# Altium schematic sheet Power.SchDoc
size 420 x 297 mm; SheetNumber: 3; SheetTotal: 5
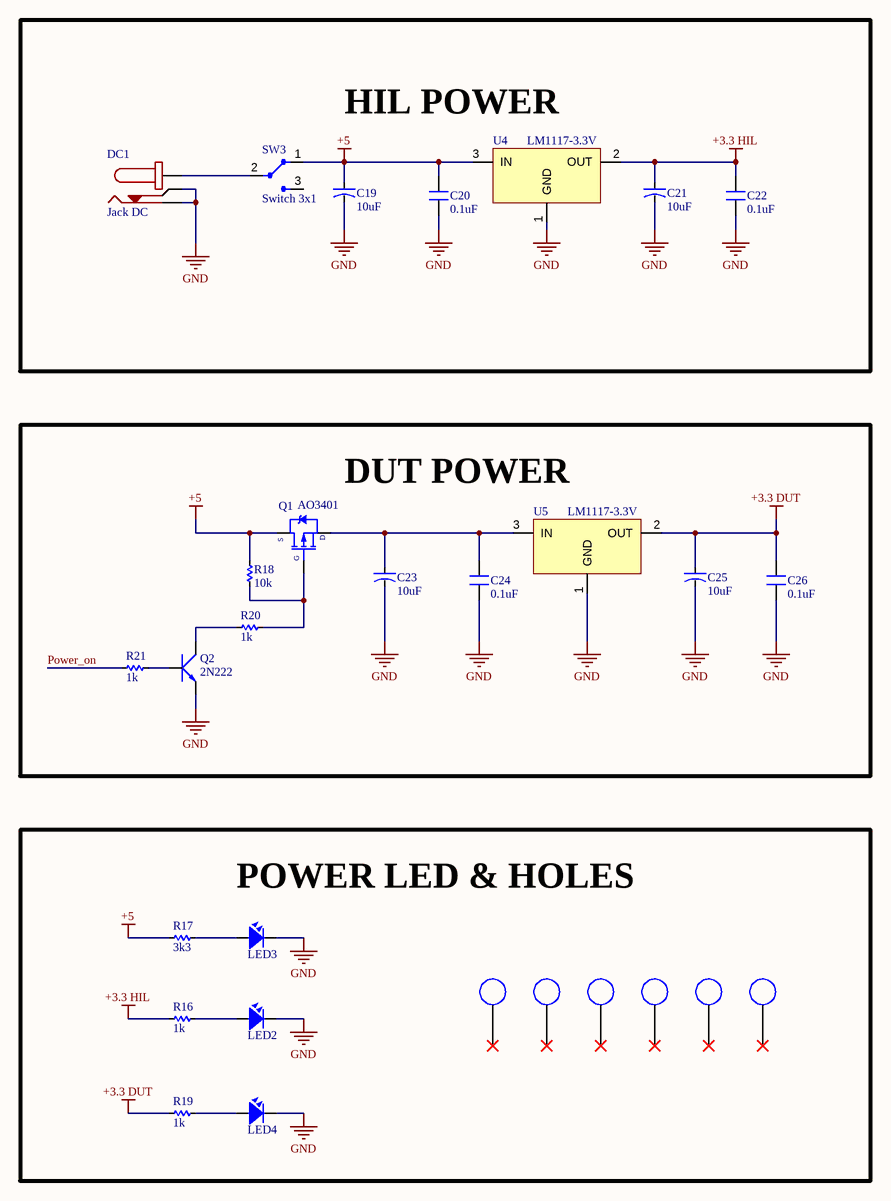
[diagram p0: Power.SchDoc]

## Parts
C19  10uF  [CAP-ALU-SMD-4.5x5x1.4]
C20  0.1uF  [CN-SMD-0603]
C21  10uF  [CAP-ALU-SMD-4.5x5x1.4]
C22  0.1uF  [CN-SMD-0603]
C23  10uF  [CAP-ALU-SMD-4.5x5x1.4]
C24  0.1uF  [CN-SMD-0603]
C25  10uF  [CAP-ALU-SMD-4.5x5x1.4]
C26  0.1uF  [CN-SMD-0603]
DC1  Jack DC  [DC0]
H1  M3  [M3]  (value not drawn)
H2  M3  [M3]  (value not drawn)
H3  M3  [M3]  (value not drawn)
H4  M3  [M3]  (value not drawn)
H5  M3  [M3]  (value not drawn)
H6  M3  [M3]  (value not drawn)
LED2  LED  [LED-0805-Red]  (value not drawn)
LED3  LED  [LED-0805-Red]  (value not drawn)
LED4  LED  [LED-0805-Red]  (value not drawn)
Q1  AO3401  [SOT23-123]
Q2  2N222  [SOT23-231]
R16  1k  [RES-SMD-0603]
R17  3k3  [RES-SMD-0603]
R18  10k  [RES-SMD-0603]
R19  1k  [RES-SMD-0603]
R20  1k  [RES-SMD-0603]
R21  1k  [RES-SMD-0603]
SW3  Switch 3x1  [SS12D00]
U4  LM1117-3.3V  [SOT223]
U5  LM1117-3.3V  [SOT223]

## Blocks framed on the sheet
HIL POWER: C19-C22 DC1 SW3 U4
DUT POWER: C23-C26 Q1 Q2 R18 R20 R21 U5
POWER LED & HOLES: H1-H6 LED2-LED4 R16 R17 R19

## Nets
+3.3 DUT: C25.1 C26.2 R19.1 U5.2(OUT)
+3.3 HIL: C21.1 C22.2 R16.1 U4.2(OUT)
+5: C19.1 C20.2 Q1.3(S) R17.1 R18.2 SW3.1 U4.3(IN)
GND: C19.2 C20.1 C21.2 C22.1 C23.2 C24.1 C25.2 C26.1 DC1.2(TN) DC1.3(T) LED2.2 LED3.2 LED4.2 Q2.1(E) U4.1(GND) U5.1(GND)
Power_on: R21.2
NetC23_1: C23.1 C24.2 Q1.2(D) U5.3(IN)
NetDC1_1: DC1.1(S) SW3.2
NetLED2_1: LED2.1 R16.2
NetLED3_1: LED3.1 R17.2
NetLED4_1: LED4.1 R19.2
NetQ1_1: Q1.1(G) R18.1 R20.1
NetQ2_2: Q2.2(B) R21.1
NetQ2_3: Q2.3(C) R20.2

Not connected (* = marked no-connect by the designer): H1 1(76)*; H2 1(76)*; H3 1(76)*; H4 1(76)*; H5 1(76)*; H6 1(76)*; SW3 3(I/O2)

## Notes on the sheet
- Project:
- Sheet title:
- BAO BUI Q.
- SAMY VE & VY TRAN
- A3
- Sheet
- Checked by:
- of
- Revision:
- Designed by:
- Size:
- Date:

## Library data of the parts
C19 C21 C23 C25 = CN-ALU-DIP: Capacitor (Semiconductor SIM Model); Value: 104; LatestRevisionDate: 17-Jul-2002; LatestRevisionNote: Re-released for DXP Platform.; PackageReference: C1206; Publisher: Altium Limited
C20 C22 C24 C26 = CN: Value: 33pF
DC1 = DCIN: Jack DC input; Value: Jac DC
LED2-LED4 = LED SMD: Value: LED 3 - 5 ly 2 Colour
Q1 = AO3401: P-MOS 30V 4A
Q2 = 2N222: NPN 600mW, ECB; Value: C1815
R16-R21 = Res-SMD: Resistor; Manufacturer: Generic Components; Class: Passive; Published: 08/06/2000; Publisher: Altium Hobart Technology Centre
SW3 = SW3x1: Value: Switch 4x2
U4 U5 = LM1117: 800mA Low-Dropout Linear Regulator; Creator: Nguyen Ba Bien; Website: http://group3i.net